# EAGLE design P1AM-ISOLATED-2X2-GPIO (EAGLE 7.7.0)
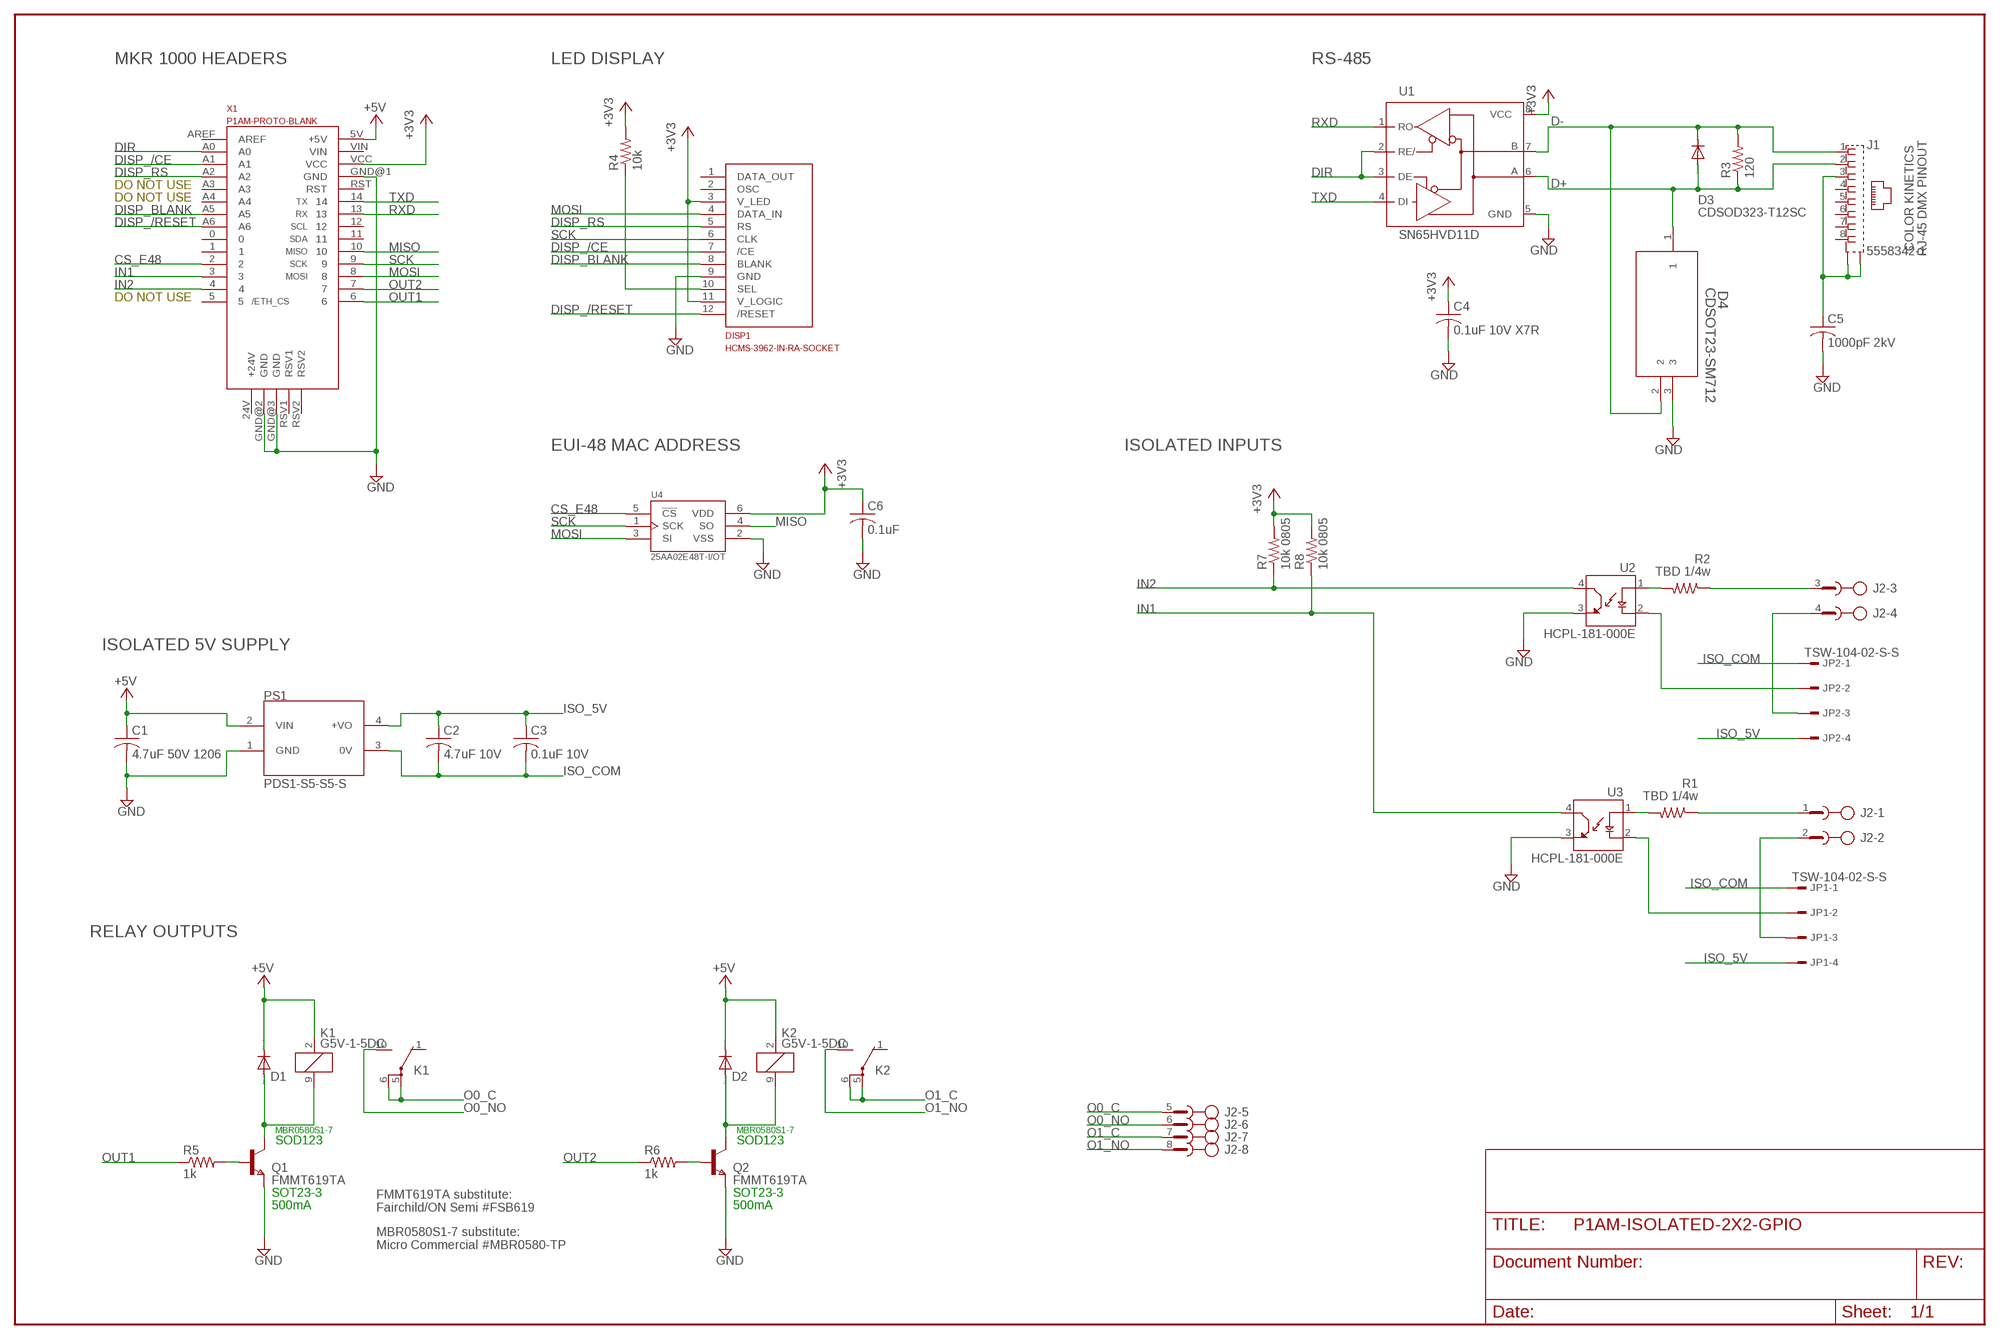
[diagram p0: schematic, sheet 1]

## Parts
C1  4.7uF 50V 1206  C-USC1206K  [C1206K]
C2  4.7uF 10V  C-USC1206K  [C1206K]
C3  0.1uF 10V  C-USC1206K  [C1206K]
C4  0.1uF 10V X7R  C-USC0805  [C0805]
C5  1000pF 2kV  C-USC1206K  [C1206K]
C6  0.1uF  C-USC0603  [C0603]
D1  1N4148W-TP  DIODE-SOD123  [SOD123]
D2  1N4148W-TP  DIODE-SOD123  [SOD123]
D3  CDSOD323-T12SC  DIODE-SOD323-W  [SOD323-W]
D4  CDSOT23-SM712  [SOT_SM712]
DISP1  HCMS-3962-IN-RA-SOCKET  [299-43-312-11-001000]
J1  5558342-1  [TE_5558342-1]
J2  PHOENIX-XXXXXXX-TERM-BLOCK-HDR-8POS-90DEG-3.5MM  [PHOENIX-XXXXXXX-TERM-BLOCK-HDR-8POS-90DEG-3.5MM]
JP1  TSW-104-02-S-S  [TSW-104-02-S-S]
JP2  TSW-104-02-S-S  [TSW-104-02-S-S]
K1  G5V-1-5DC  G5V1  [G5V1]
K2  G5V-1-5DC  G5V1  [G5V1]
PS1  PDS1-S5-S5-S  [CONV_PDS1-S5-S5-S]
Q1  FMMT619TA  NPNSOT23  [SOT-23]
Q2  FMMT619TA  NPNSOT23  [SOT-23]
R1  TBD 1/4w  R-US_R1206  [R1206]
R2  TBD 1/4w  R-US_R1206  [R1206]
R3  120  R-US_R0805  [R0805]
R4  10k  R-US_R0805  [R0805]
R5  1k  R-US_R1206  [R1206]
R6  1k  R-US_R1206  [R1206]
R7  10k 0805  R-US_R0805  [R0805]
R8  10k 0805  R-US_R0805  [R0805]
U1  SN65HVD11D  MAX3468CSA  [SO08]
U2  HCPL-181-000E  [SOIC254P675X240-4N]
U3  HCPL-181-000E  [SOIC254P675X240-4N]
U4  25AA02E48T-I/OT  [SOT95P270X145-6N]
X1  P1AM-PROTO-BLANK  [P1AM-PROTO-BLANK]

## Nets
+3V3: C4.1 C6.1 DISP1.3(V_LED) DISP1.11(V_LOGIC) R4.2 R7.2 R8.2 U1.8(VCC) U4.6(VDD) X1.VCC
+5V: C1.1 D1.C D2.C K1.2 K2.2 PS1.2(VIN) X1.5V(+5V)
CS_E48: U4.5(!CS) X1.2
D+: D3.A D4.1 J1.2 R3.1 U1.6(A)
D-: D3.C D4.2 J1.1 R3.2 U1.7(B)
DIR: U1.2(RE/) U1.3(DE) X1.A0
DISP_/CE: DISP1.7(/CE) X1.A1
DISP_/RESET: DISP1.12(/RESET) X1.A6
DISP_BLANK: DISP1.8(BLANK) X1.A5
DISP_RS: DISP1.5(RS) X1.A2
GND: C1.2 C4.2 C5.2 C6.2 D4.3 DISP1.9(GND) PS1.1(GND) Q1.2(E) Q2.2(E) U1.5(GND) U2.3(EMITTER) U3.3(EMITTER) U4.2(VSS) X1.GND@1(GND) X1.GND@2(GND) X1.GND@3(GND)
IN1: R8.1 U3.4(COLLECTOR) X1.3
IN2: R7.1 U2.4(COLLECTOR) X1.4
ISO_5V: C2.1 C3.1 JP1.4 JP2.4 PS1.4(+VO)
ISO_COM: C2.2 C3.2 JP1.1 JP2.1 PS1.3(0V)
MISO: U4.4(SO) X1.10
MOSI: DISP1.4(DATA_IN) U4.3(SI) X1.8
N$1: R1.2 U3.1(ANODE)
N$2: JP1.2 U3.2(CATHODE)
N$3: Q2.3(B) R6.2
N$4: D2.A K2.9 Q2.1(C)
N$5: J2.3 R2.1
N$6: J2.2 JP1.3
N$7: R2.2 U2.1(ANODE)
N$8: JP2.2 U2.2(CATHODE)
N$9: J2.1 R1.1
N$10: J2.4 JP2.3
N$11: C5.1 J1.3 J1.SH1(S1) J1.SH2(S2)
N$14: DISP1.10(SEL) R4.1
N$16: Q1.3(B) R5.2
N$200: D1.A K1.9 Q1.1(C)
O0_C: J2.5 K1.5(2:P) K1.6(2:P)
O0_NO: J2.6 K1.10(2:S)
O1_C: J2.7 K2.5(2:P) K2.6(2:P)
O1_NO: J2.8 K2.10(2:S)
OUT1: R5.1 X1.6
OUT2: R6.1 X1.7
RXD: U1.1(RO) X1.13
SCK: DISP1.6(CLK) U4.1(SCK) X1.9
TXD: U1.4(DI) X1.14
Unconnected: DISP1.1(DATA_OUT) DISP1.2(OSC) J1.4 J1.5 J1.6 J1.7 J1.8 K1.1(2:O) K2.1(2:O) X1.0 X1.1 X1.5 X1.11 X1.12 X1.24V(+24V) X1.A3 X1.A4 X1.AREF X1.RST X1.RSV1 X1.RSV2 X1.VIN

## Notes on the sheet
- MKR 1000 HEADERS | LED DISPLAY | RS-485
- DO NOT USE
- COLOR KINETICS
  RJ-45 DMX PINOUT
- DO NOT USE | TX
- RX
- SCL
- SDA
- MISO
- SCK
- MOSI
- DO NOT USE | /ETH_CS
- EUI-48 MAC ADDRESS | ISOLATED INPUTS
- ISOLATED 5V SUPPLY
- RELAY OUTPUTS
- MBR0580S1-7 | MBR0580S1-7
- SOD123 | SOD123
- SOT23-3 | SOT23-3
- 500mA | 500mA
- FMMT619TA substitute:
  Fairchild/ON Semi #FSB619
- MBR0580S1-7 substitute:
  Micro Commercial #MBR0580-TP

## Library data of the parts
C1 C3 = rcl:C-US: CAPACITOR, American symbol; MFR_PART_NO: C1206C475K5RACTU
C2 C4-C6 = rcl:C-US: CAPACITOR, American symbol
D1 D2 = diode:DIODE-: DIODE; MFR: DIODES INC; MFR_PART_NO: MBR0580S1-7
D3 = diode:DIODE-: DIODE
D4 = CDSOT23-SM712:CDSOT23-SM712; BUILT_BY: EMA_Matt; MANUFACTURER_PART_NUMBER: CDSOT23-SM712; VENDOR: Bourns Electronics
DISP1 = display-in-socket:HCMS-3962-IN-RA-SOCKET: HCMS-3962 4 CHARACTER 0.180" DISPLAY IN 299-43-312-11-001000 RIGHT ANGLE SOCKET.
J1 = 5558342-1:5558342-1: CONN MOD JACK 8P8C R/A SHIELDED; COMMENT: 5558342-1; DESCRIPTION: Conn RJ-45 F 8 POS 2.54mm Solder RA Thru-Hole 8 Terminal 1 Port Cat 5 Box/Tray; DIGI-KEY_PART_NUMBER: A31466-ND; DIGI-KEY_PURCHASE_URL: https://www.digikey.com/product-detail/en/te-connectivity-amp-connectors/5558342-1/A31466-ND/769610?utm_source=snapeda&utm_medium=aggregator&utm_campaign=symbol; EU_ROHS_COMPLIANCE: Compliant; MF: TE Connectivity; MP: 5558342-1; PACKAGE: None; TE_PURCHASE_URL: https://www.te.com/usa-en/product-5558342-1.html?te_bu=Cor&te_type=disp&te_campaign=seda_glo_cor-seda-global-disp-prtnr-fy19-seda-model-bom-cta_sma-317_1&elqCampaignId=32493
J2 = phoenix-term-block-hdr:PHOENIX-XXXXXXX-TERM-BLOCK-HDR-8POS-90DEG-3.5MM
JP1 JP2 = con-samtec:TSW-104-02-S-S: THROUGH-HOLE .025" SQ POST HEADER Source: Samtec TSW.pdf; OC_FARNELL: unknown; OC_NEWARK: unknown
K1 K2 = relay:G5V1: RELAY 1 x switch, 0.5 A/125 V AC, 1 A/24 V DC , Omron; MFR: OMRON; MFR_PART_NO: G5V-1-DC5; MPN: G5V-1-DC24; OC_FARNELL: 9949593; OC_NEWARK: 36M6377
PS1 = PDS1-S5-S5-S:PDS1-S5-S5-S: 12 Vdc, 0.083 A, 1 W, 10.8~13.2 Vdc Input Range; AVAILABILITY: Good; DESCRIPTION: PDS1 Series 1 W 12 VDC 83 mA Single Output DC-DC Isolated Converter; MF: CUI; MP: PDS1-S12-S12-S; PACKAGE: SIP-4 CUI; PRICE: 3.90 USD
Q1 Q2 = zetex:NPNSOT23: NPN TRANSISTOR; MFR: DIODES INC; MFR_PART_NO: FMMT619TA; MPN: DSS20201L-7; OC_FARNELL: 1710688; OC_NEWARK: 25R4555
R1-R4 = rcl:R-US_: RESISTOR, American symbol
R5 R6 = rcl:R-US_: RESISTOR, American symbol; MFR: BOURNS; MFR_PART_NO: CR1206-JW-102ELF
R7 R8 = resistor:R-US_: RESISTOR, American symbol
U1 = maxim:MAX34*: +5V, Fail-Safe, 40Mbps, Profibus RS-485/RS-422 Transceivers Source: MAX3465-MAX3469.pdf; MPN: MAX3468CSA+; OC_FARNELL: unknown; OC_NEWARK: 76K6721
U2 U3 = HCPL-181-000E:HCPL-181-000E: Optocoupler; SMD; Channels: 1; Out: transistor; Uinsul: 3.75kV; SO4; DESCRIPTION: Optocoupler; SMD; Channels: 1; Out: transistor; Uinsul: 3.75kV; SO4; DIGI-KEY_PART_NUMBER: 516-1646-1-ND; DIGI-KEY_PURCHASE_URL: https://www.digikey.com/product-detail/en/broadcom-limited/HCPL-181-000E/516-1646-1-ND/825340?utm_source=snapeda&utm_medium=aggregator&utm_campaign=symbol; MF: Broadcom Limited; MP: HCPL-181-000E; PACKAGE: SO-4 Broadcom
U4 = 25AA02E48T-I_OT:25AA02E48T-I/OT: 25AA02E48 Series 2 Kbit (256 x 8) 5.5 V SMT SPI Bus Serial EEPROM - SOT-23-6; DESCRIPTION: 25AA02E48 Series 2 Kbit _256 x 8_ 5.5 V SMT SPI Bus Serial EEPROM - SOT-23-6; DIGI-KEY_PART_NUMBER: 25AA02E48T-I/OTCT-ND; DIGI-KEY_PURCHASE_URL: https://www.digikey.com/product-detail/en/microchip-technology/25AA02E48T-I-OT/25AA02E48T-I-OTCT-ND/2060055?utm_source=snapeda&utm_medium=aggregator&utm_campaign=symbol; MF: Microchip; MP: 25AA02E48T-I/OT; PACKAGE: SOT-23-6 Microchip
X1 = P1AM-PROTO-BLANK:P1AM-PROTO-BLANK

## Board
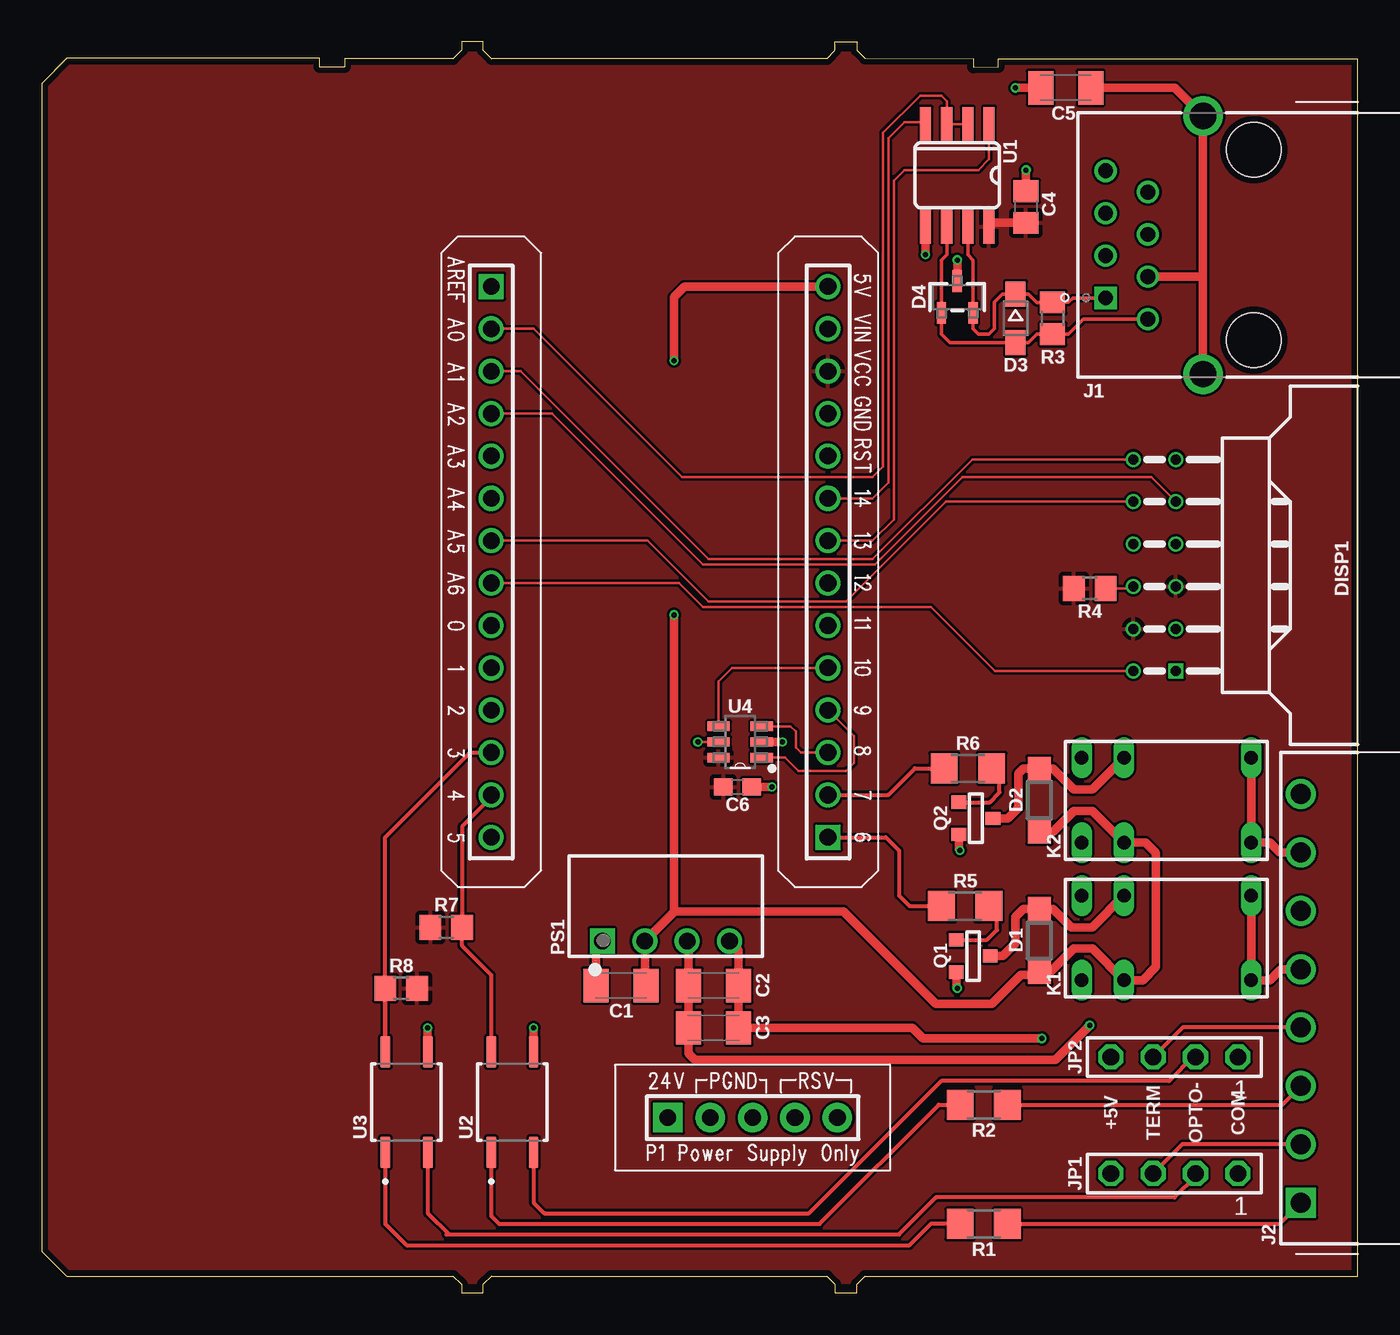
[diagram p1: board, top side]
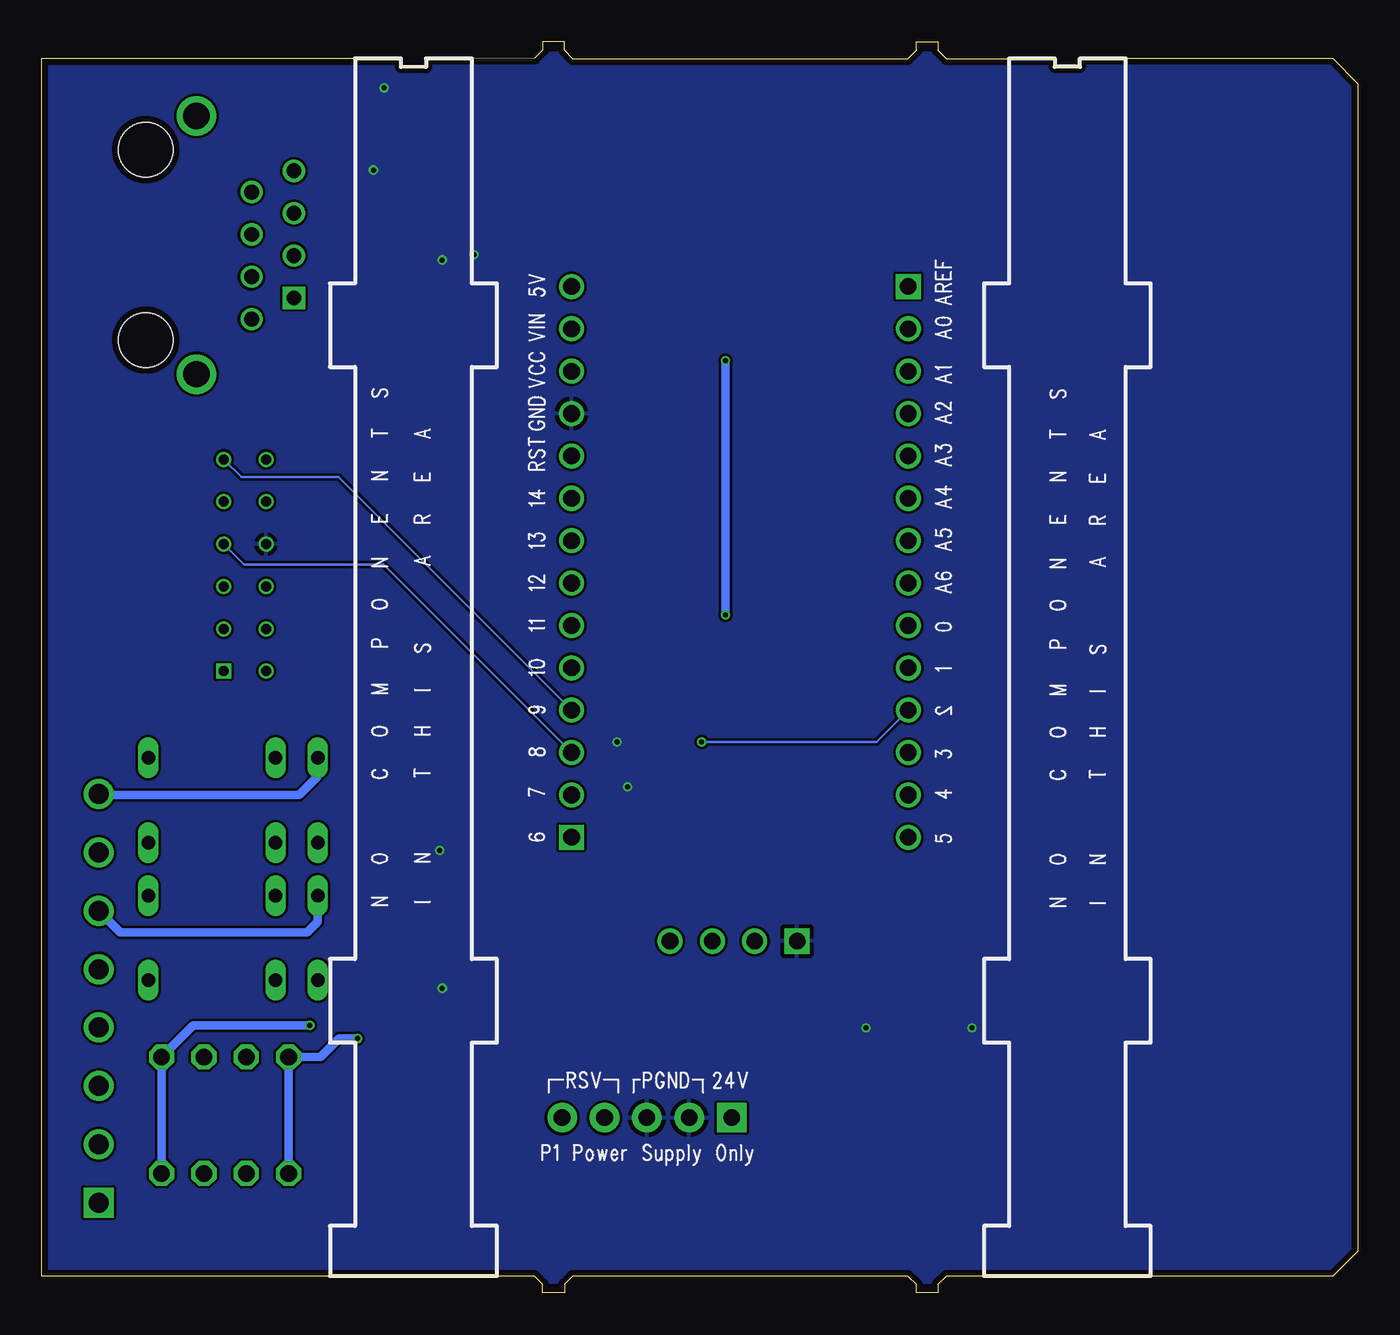
[diagram p2: board, bottom side, seen from below]

Size 78.9 x 75.01 mm. Coordinates in mm from the lower left corner, seen from the top.
Copper layers (1*16): Top 0.035559375mm / dielectric 1.6mm / Bottom 0.035559375mm
Design rules "oshpark-2layer-2018": minimum track width 6mil, minimum drill 10mil, track to track 6mil, track to pad 6mil, pad to pad 6mil, via to via 6mil, smd to smd 6mil, copper to edge 15mil, drill to drill 6mil, minimum pad ring 5mil, minimum via ring 5mil, stop-mask expansion 2.5mil, vias tented up to drill 0mil, thermal gap 10mil

### Footprints (pad centres in the part's own frame; a part is rotated, then mirrored left to right if it is on the bottom)
C1206K = smd 1.5 x 2: 1 -1.5,0; 2 1.5,0
C0805 = smd 1.3 x 1.5: 1 -0.95,0; 2 0.95,0
C0603 = smd 1.1 x 1: 1 -0.85,0; 2 0.85,0
SOD123 = smd 1.4 x 1.4: A 1.9,0; C -1.9,0
SOD323-W = smd 1.5 x 1.2: A 1.45,0; C -1.45,0
SOT_SM712 = smd 0.559 x 1.295: 1 -0.95,-0.953; 2 0.95,-0.953; 3 0,0.953
299-43-312-11-001000 = drill 0.6 square: 1 -6.35,10.897 | drill 0.6: 2 -3.81,10.897; 3 -1.27,10.897; 4 1.27,10.897; 5 3.81,10.897; 6 6.35,10.897; 7 6.35,13.437; 8 3.81,13.437; 9 1.27,13.437; 10 -1.27,13.437; 11 -3.81,13.437; 12 -6.35,13.437
TE_5558342-1 = drill 0.89 square: 1 -3.175,8.89 | drill 0.89: 2 -4.445,6.35; 3 -1.905,6.35; 4 0.635,6.35; 5 -0.635,8.89; 6 1.905,8.89; 7 4.445,8.89; 8 3.175,6.35 | drill 1.58: SH1 -7.745,3.05; SH2 7.745,3.05 | hole 3.25: -5.715,0; 5.715,0
PHOENIX-XXXXXXX-TERM-BLOCK-HDR-8POS-90DEG-3.5MM = drill 1.2 square: 1 0,0 | drill 1.2: 2 3.5,0; 3 7,0; 4 10.5,0; 5 14,0; 6 17.5,0; 7 21,0; 8 24.5,0
TSW-104-02-S-S = drill 1 pad 1.5 octagon: 1 3.81,0; 2 1.27,0; 3 -1.27,0; 4 -3.81,0
G5V1 = drill 0.813 long: 1 -5.08,-2.54; 2 -2.54,-2.54; 5 5.08,-2.54; 6 5.08,2.54; 9 -2.54,2.54; 10 -5.08,2.54
CONV_PDS1-S5-S5-S = drill 1 square: 1 -3.81,-2.1 | drill 1: 2 -1.27,-2.1; 3 1.27,-2.1; 4 3.81,-2.1
SOT-23 = smd 0.787 x 0.889: 1 0.025,-1.016; 2 -0.94,1.016; 3 0.991,1.016
R1206 = smd 1.6 x 1.803: 1 -1.422,0; 2 1.422,0
R0805 = smd 1.3 x 1.5: 1 -0.95,0; 2 0.95,0
SO08 = smd 0.66 x 2.032: 1 -1.905,-3.073; 2 -0.635,-3.073; 3 0.635,-3.073; 4 1.905,-3.073; 5 1.905,3.073; 6 0.635,3.073; 7 -0.635,3.073; 8 -1.905,3.073
SOIC254P675X240-4N = smd 1.89 x 0.59: 1 -3.01,1.27; 2 -3.01,-1.27; 3 3.01,-1.27; 4 3.01,1.27
SOT95P270X145-6N = smd 1.321 x 0.559: 1 -1.295,0.94; 2 -1.295,0; 3 -1.295,-0.94; 4 1.295,-0.94; 5 1.295,0; 6 1.295,0.94
P1AM-PROTO-BLANK = drill 1: 0 26.67,38.735; 1 26.67,36.195; 2 26.67,33.655; 3 26.67,31.115; 4 26.67,28.575; 5 26.67,26.035; 5V 46.863,59.055; 7 46.863,28.575; 8 46.863,31.115; 9 46.863,33.655; 10 46.863,36.195; 11 46.863,38.735; 12 46.863,41.275; 13 46.863,43.815; 14 46.863,46.355; A0 26.67,56.515; A1 26.67,53.975; A2 26.67,51.435; A3 26.67,48.895; A4 26.67,46.355; A5 26.67,43.815; A6 26.67,41.275; GND@1 46.863,51.435; RST 46.863,48.895; VCC 46.863,53.975; VIN 46.863,56.515 | drill 1 square: 6 46.863,26.035; AREF 26.67,59.055 | drill 1 pad 1.778 square: 24V 37.262,9.22 | drill 1 pad 1.778: GND@2 39.802,9.22; GND@3 42.342,9.22; RSV1 44.882,9.22; RSV2 47.422,9.22

### Placement (x,y rotation side)
C1  34.73,18.42 180 top
C2  40.28,18.42 180 top
C3  40.28,15.88 180 top
C4  59.02,65.1 90 top
C5  61.4,72.24 180 top
C6  41.71,30.33 0 top
D1  59.81,21.12 90 top
D2  59.81,29.54 90 top
D3  58.38,58.43 270 top
D4  54.89,59.7 0 top
DISP1  78.89,43.62 90 top
J1  72.67,62.82 90 top
J2  75.49,5.41 90 top
JP1  67.91,7.15 0 top
JP2  67.91,14.14 0 top
K1  67.43,21.28 0 top
K2  67.43,29.54 0 top
PS1  37.43,23.19 0 top
Q1  55.84,20.17 90 top
Q2  56,28.42 90 top
R1  56.48,4.14 180 top
R2  56.48,11.28 180 top
R3  60.6,58.43 90 top
R4  62.83,42.24 180 top
R5  55.37,23.19 0 top
R6  55.52,31.44 0 top
R7  24.25,21.92 180 top
R8  21.55,18.26 0 top
U1  54.89,67 180 top
U2  28.22,11.44 90 top
U3  21.87,11.44 90 top
U4  41.87,33.03 180 top
X1  0.28,1.28 0 top

### Tracks (layer width: path | path; a pad name or v marks a point on that pad's centre or on a via)
+3V3
  Top 0.203: 57.01,64.14 U1.8
  Top 0.508: C4.1 57.01,64.14
  pour Top (isolate 0.152): -0.36,0.64 79.02,0.64 79.02,74.3 -0.36,74.3
+5V  (via drill 0.3)
  Top 0.508: D2.C 60.61,27.64 61.87,28.9 62.99,28.9 K2.2 66.16,27 66.8,26.36 66.8,19.53 66,18.74 K1.2 62.99,20.64 61.87,20.64 60.45,19.22 D1.C 59.65,19.06 58.7,19.06 56.95,17.31 53.62,17.31 48.06,22.87 37.94,22.87 | X1.5V 38.54,60.33 37.9,59.7 v37.9,55.89 | v37.9,40.65 37.9,22.87 37.94,22.87 | C1.1 36.16,18.49 PS1.2 37.94,22.87
  Bottom 0.508: v37.9,55.89 v37.9,40.65
CS_E48  (via drill 0.3)
  Top 0.152: U4.5 v39.33,33.03
  Bottom 0.152: v39.33,33.03 28.85,33.03 X1.2
D+
  Top 0.203: U1.6 54.25,62.24 53.94,61.92 D4.1 53.94,57.47 54.43,56.98 D3.A 59.15,56.98 59.65,57.48 R3.1 61.56,57.47 62.46,58.38 J1.2
D-
  Top 0.203: U1.7 55.52,62.24 55.84,61.92 D4.2 55.84,57.79 56.16,57.47 56.79,57.47 57.11,57.79 57.11,59.38 57.61,59.88 D3.C 59.15,59.88 59.65,59.38 R3.2 61.56,59.38 61.82,59.65 J1.1
DIR
  Top 0.152: U1.2 U1.3 54.25,71.45 53.94,71.76 52.67,71.76 50.44,69.54 50.44,49.54 49.81,48.9 38.38,48.9 29.49,57.79 X1.A0
DISP_/CE
  Top 0.152: DISP1.7 55.8,49.97 49.81,43.98 39.97,43.98 28.7,55.25 X1.A1
DISP_/RESET
  Top 0.152: DISP1.12 57.16,37.27 53.3,41.12 39.65,41.12 38.22,42.55 X1.A6
DISP_BLANK
  Top 0.152: DISP1.8 54.21,47.43 48.22,41.44 39.97,41.44 36.32,45.09 X1.A5
DISP_RS
  Top 0.152: DISP1.5 66.52,48.9 55.21,48.9 49.97,43.66 39.65,43.66 30.6,52.71 X1.A2
GND  (via drill 0.3)
  Top 0.508: U1.5 v52.98,62.24 | D4.3 v54.89,61.92 | C4.2 v59.02,67.32 | C5.2 v58.38,72.24 | Q2.2 54.98,26.58 v55.05,26.52 | Q1.2 54.83,18.33 v54.89,18.26 | C1.2 33.23,20.7 PS1.1 | U3.3 v23.14,15.88 | U2.3 v29.49,15.88 | C6.2 v43.78,30.33 | U4.2 v44.41,33.03
  pour Bottom (isolate 0.152): -0.36,0.64 79.02,0.64 79.02,74.3 -0.36,74.3
IN1
  Top 0.254: X1.3 25.68,32.39 20.6,27.31 U3.4 R8.1
IN2
  Top 0.254: X1.4 26.95,29.69 25.2,27.95 R7.1 | U2.4 26.95,19.06 25.2,20.8 R7.1 | R7.1
ISO_5V  (via drill 0.3)
  Top 0.508: PS1.4 41.78,20.54 C2.1 C3.1 52.19,15.88 52.83,15.25 v59.97,15.25
  Bottom 0.508: JP1.4 JP2.4 62.19,14.14 61.08,15.25 v59.97,15.25
ISO_COM  (via drill 0.3)
  Top 0.508: PS1.3 38.78,21 C2.2 C3.2 38.78,14.37 39.17,13.98 60.76,13.98 v62.83,16.04
  Bottom 0.508: JP1.1 JP2.1 69.81,16.04 v62.83,16.04
MISO
  Top 0.152: U4.4 40.58,36.65 41.4,37.47 X1.10
MOSI
  Top 0.152: U4.3 44.9,33.97 45.21,33.66 45.21,32.71 45.52,32.39 X1.8
  Bottom 0.152: DISP1.4 66.77,43.66 58.41,43.66 X1.8
N$1
  Top 0.254: R1.2 53.3,4.13 52.03,2.86 21.87,2.86 20.6,4.13 U3.1
N$2
  Top 0.254: 24.25,3.5 24.41,3.5 | 24.41,3.5 51.4,3.5 53.62,5.72 67.91,5.72 69.18,6.99 JP1.2 | U3.2 23.14,4.77 24.41,3.5
N$3
  Top 0.254: Q2.3 56.83,29.41 57.43,30.01 57.43,31.43 R6.2
N$4
  Top 0.254: D2.A
  Top 0.508: D2.A 60.61,31.43 61.87,30.17 62.99,30.17 K2.9 | Q2.1 57.93,28.45 58.54,29.06 58.54,31.12 58.86,31.44 D2.A
N$5
  Top 0.254: R2.1 74.36,11.28 J2.3
N$6
  Top 0.254: J2.2 68.39,8.91 JP1.3
N$7
  Top 0.254: U2.1 26.95,4.61 27.43,4.13 46.63,4.13 53.78,11.28 R2.2
N$8
  Top 0.254: JP2.2 69.02,14.14 67.59,12.71 53.94,12.71 46,4.77 30.12,4.77 29.49,5.41 U2.2
N$9
  Top 0.254: R1.1 74.22,4.13 J2.1
N$10
  Top 0.254: J2.4 68.41,15.9 JP2.3
N$11
  Top 0.508: 69.62,60.97 J1.SH2 67.95,72.24 C5.1 | 69.62,60.97 J1.SH1 | J1.3 69.57,60.92 69.62,60.97
N$14
  Top 0.152: R4.1 65.34,42.24 DISP1.10
N$16
  Top 0.254: Q1.3 56.67,21.16 57.27,21.76 57.27,23.02 R5.2
N$200
  Top 0.254: D1.A
  Top 0.508: D1.A 60.61,23.02 61.72,21.91 62.99,21.91 K1.9 | Q1.1 57.61,20.19 58.38,20.96 58.38,22.55 58.86,23.03 D1.A
O0_C
  Top 0.508: K1.6 K1.5 73.62,18.74 74.29,19.41 J2.5
O0_NO
  Bottom 0.508: K1.10 62.35,22.23 62.99,21.6 74.18,21.6 J2.6
O1_C
  Top 0.508: K2.6 K2.5 73.62,27 74.21,26.41 J2.7
O1_NO
  Bottom 0.508: K2.10 62.35,30.96 63.46,29.85 75.44,29.85 J2.8
OUT1
  Top 0.254: X1.6 50.6,27.31 51.4,26.52 51.4,23.82 52.03,23.18 R5.1
OUT2
  Top 0.254: X1.7 50.76,29.85 52.35,31.44 R6.1
RXD
  Top 0.152: X1.13 49.81,45.09 51.08,46.36 51.08,66.68 51.71,67.32 56.16,67.32 56.79,67.95 U1.1
SCK
  Top 0.152: U4.1 44.56,32.09 45.36,31.28 48.22,31.28 48.7,31.76 48.7,33.38 X1.9
  Bottom 0.152: DISP1.6 66.93,48.9 61.11,48.9 X1.9
TXD
  Top 0.152: X1.14 49.81,47.63 50.76,48.58 50.76,69.22 51.71,70.17 52.88,70.17 U1.4

### Text on the board
_tsilk: C5 | U1 | C4 | D4 | D3 | R3 | J1 | DISP1 | R4 | U4 | R6 | C6 | D2 | Q2 | K2 | R5 | R7 | D1 | PS1 | Q1 | R8 | C2 | K1 | C1 | C3 | JP2 | +5V | TERM | OPTO- | COM | R2 | U3 | U2 | JP1 | R1 | J2